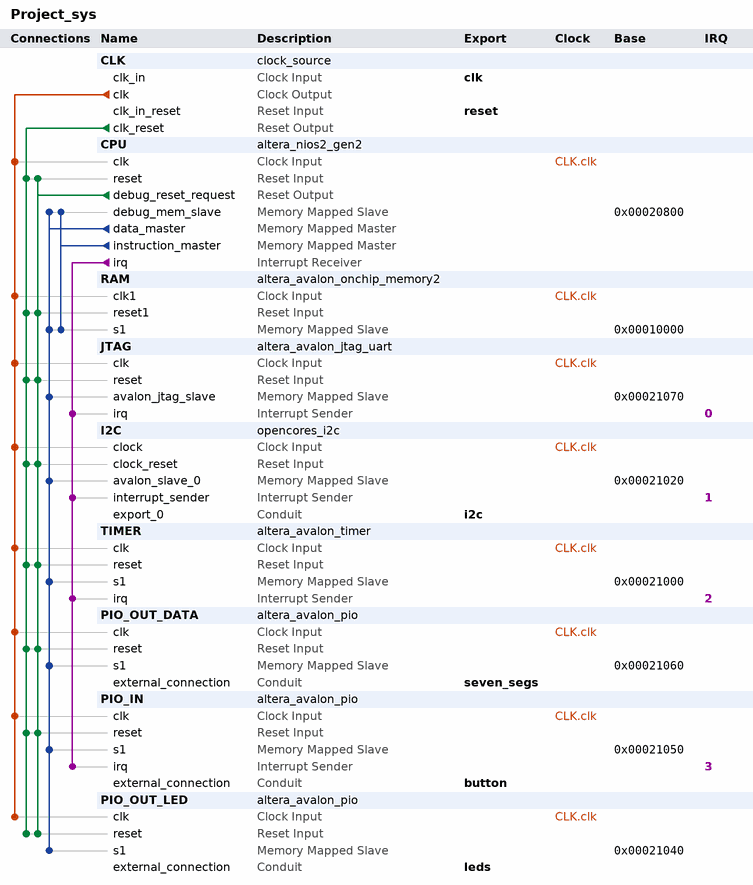
[diagram p0: system contents]
# Platform Designer (Qsys) system Project_sys, MAX 10 10M50DAF484C7G
# Parameters at their usual value, and those the tool derives, are not listed.
package require -exact qsys 18.1
create_system Project_sys
set_project_property DEVICE_FAMILY {MAX 10}
set_project_property DEVICE 10M50DAF484C7G

add_instance CLK clock_source 18.1
set_instance_parameter_value CLK clockFrequency 50000000

add_instance CPU altera_nios2_gen2 18.1
set_instance_parameter_value CPU dcache_size 2048
set_instance_parameter_value CPU exceptionSlave RAM.s1
set_instance_parameter_value CPU icache_size 4096
set_instance_parameter_value CPU impl Tiny
set_instance_parameter_value CPU resetSlave RAM.s1

add_instance RAM altera_avalon_onchip_memory2 18.1
set_instance_parameter_value RAM dataWidth 32
set_instance_parameter_value RAM dualPort false
set_instance_parameter_value RAM initMemContent false
set_instance_parameter_value RAM initializationFileName onchip_mem.hex
set_instance_parameter_value RAM memorySize 40000

add_instance JTAG altera_avalon_jtag_uart 18.1
set_instance_parameter_value JTAG simInteractiveOptions NO_INTERACTIVE_WINDOWS

add_instance I2C opencores_i2c 9.1

add_instance TIMER altera_avalon_timer 18.1
set_instance_parameter_value TIMER period 100
set_instance_parameter_value TIMER periodUnits MSEC

add_instance PIO_OUT_DATA altera_avalon_pio 18.1
set_instance_parameter_value PIO_OUT_DATA direction Output
set_instance_parameter_value PIO_OUT_DATA width 24

add_instance PIO_IN altera_avalon_pio 18.1
set_instance_parameter_value PIO_IN captureEdge true
set_instance_parameter_value PIO_IN direction Input
set_instance_parameter_value PIO_IN generateIRQ true
set_instance_parameter_value PIO_IN irqType EDGE
set_instance_parameter_value PIO_IN width 1

add_instance PIO_OUT_LED altera_avalon_pio 18.1
set_instance_parameter_value PIO_OUT_LED direction Output
set_instance_parameter_value PIO_OUT_LED width 10

# connections
add_connection CLK.clk CPU.clk clock
add_connection CLK.clk I2C.clock clock
add_connection CLK.clk JTAG.clk clock
add_connection CLK.clk PIO_IN.clk clock
add_connection CLK.clk PIO_OUT_DATA.clk clock
add_connection CLK.clk PIO_OUT_LED.clk clock
add_connection CLK.clk RAM.clk1 clock
add_connection CLK.clk TIMER.clk clock
add_connection CLK.clk_reset CPU.reset reset
add_connection CLK.clk_reset I2C.clock_reset reset
add_connection CLK.clk_reset JTAG.reset reset
add_connection CLK.clk_reset PIO_IN.reset reset
add_connection CLK.clk_reset PIO_OUT_DATA.reset reset
add_connection CLK.clk_reset PIO_OUT_LED.reset reset
add_connection CLK.clk_reset RAM.reset1 reset
add_connection CLK.clk_reset TIMER.reset reset
add_connection CPU.debug_reset_request CPU.reset reset
add_connection CPU.debug_reset_request I2C.clock_reset reset
add_connection CPU.debug_reset_request JTAG.reset reset
add_connection CPU.debug_reset_request PIO_IN.reset reset
add_connection CPU.debug_reset_request PIO_OUT_DATA.reset reset
add_connection CPU.debug_reset_request PIO_OUT_LED.reset reset
add_connection CPU.debug_reset_request RAM.reset1 reset
add_connection CPU.debug_reset_request TIMER.reset reset
add_connection CPU.data_master CPU.debug_mem_slave avalon
set_connection_parameter_value CPU.data_master/CPU.debug_mem_slave baseAddress 0x00020800
add_connection CPU.data_master I2C.avalon_slave_0 avalon
set_connection_parameter_value CPU.data_master/I2C.avalon_slave_0 baseAddress 0x00021020
add_connection CPU.data_master JTAG.avalon_jtag_slave avalon
set_connection_parameter_value CPU.data_master/JTAG.avalon_jtag_slave baseAddress 0x00021070
add_connection CPU.data_master PIO_IN.s1 avalon
set_connection_parameter_value CPU.data_master/PIO_IN.s1 baseAddress 0x00021050
add_connection CPU.data_master PIO_OUT_DATA.s1 avalon
set_connection_parameter_value CPU.data_master/PIO_OUT_DATA.s1 baseAddress 0x00021060
add_connection CPU.data_master PIO_OUT_LED.s1 avalon
set_connection_parameter_value CPU.data_master/PIO_OUT_LED.s1 baseAddress 0x00021040
add_connection CPU.data_master RAM.s1 avalon
set_connection_parameter_value CPU.data_master/RAM.s1 baseAddress 0x00010000
add_connection CPU.data_master TIMER.s1 avalon
set_connection_parameter_value CPU.data_master/TIMER.s1 baseAddress 0x00021000
add_connection CPU.instruction_master CPU.debug_mem_slave avalon
set_connection_parameter_value CPU.instruction_master/CPU.debug_mem_slave baseAddress 0x00020800
add_connection CPU.instruction_master RAM.s1 avalon
set_connection_parameter_value CPU.instruction_master/RAM.s1 baseAddress 0x00010000
add_connection CPU.irq I2C.interrupt_sender interrupt
set_connection_parameter_value CPU.irq/I2C.interrupt_sender irqNumber 1
add_connection CPU.irq JTAG.irq interrupt
set_connection_parameter_value CPU.irq/JTAG.irq irqNumber 0
add_connection CPU.irq PIO_IN.irq interrupt
set_connection_parameter_value CPU.irq/PIO_IN.irq irqNumber 3
add_connection CPU.irq TIMER.irq interrupt
set_connection_parameter_value CPU.irq/TIMER.irq irqNumber 2

# exported interfaces
add_interface button conduit end
set_interface_property button EXPORT_OF PIO_IN.external_connection
add_interface clk clock sink
set_interface_property clk EXPORT_OF CLK.clk_in
add_interface i2c conduit end
set_interface_property i2c EXPORT_OF I2C.export_0
add_interface leds conduit end
set_interface_property leds EXPORT_OF PIO_OUT_LED.external_connection
add_interface reset reset sink
set_interface_property reset EXPORT_OF CLK.clk_in_reset
add_interface seven_segs conduit end
set_interface_property seven_segs EXPORT_OF PIO_OUT_DATA.external_connection

set_interconnect_requirement {$system} qsys_mm.clockCrossingAdapter HANDSHAKE
set_interconnect_requirement {$system} qsys_mm.enableEccProtection FALSE
set_interconnect_requirement {$system} qsys_mm.insertDefaultSlave FALSE
set_interconnect_requirement {$system} qsys_mm.maxAdditionalLatency 1

save_system Project_sys.qsys
